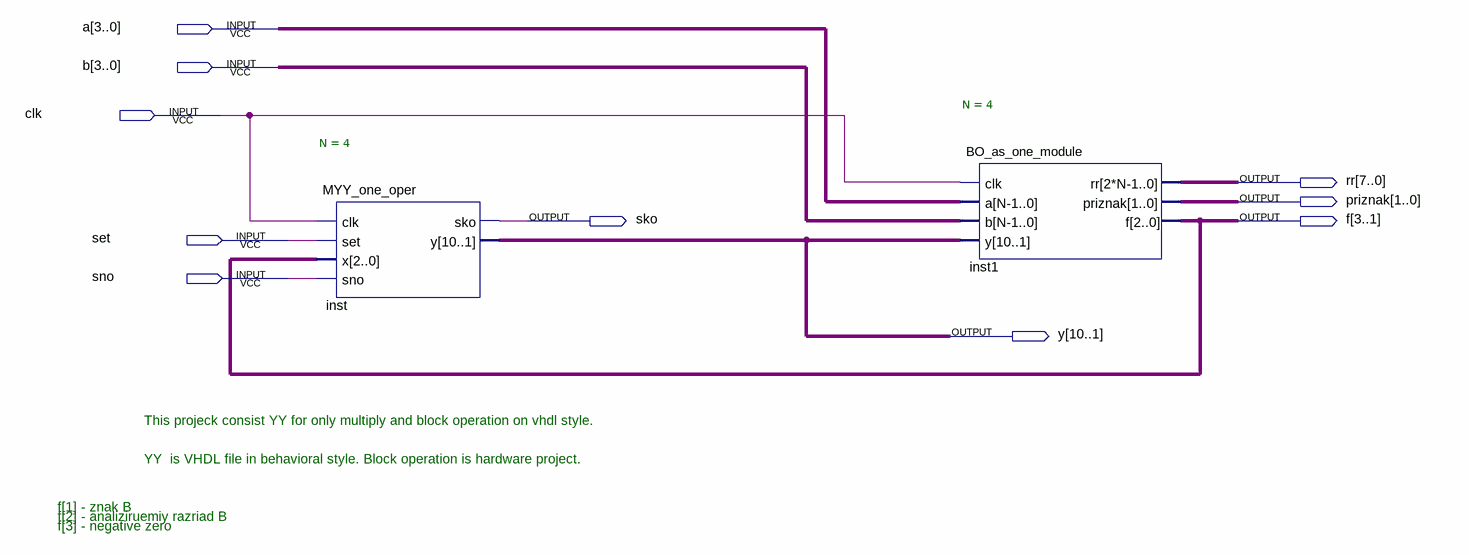
[diagram p0: schematic sheet]
// Quartus schematic alu_vhdl.bdf as structural Verilog: 2 symbols, 10 pins
module alu_vhdl (
  input  [3:0] a,
  input  [3:0] b,
  input  clk,
  input  set,
  input  sno,
  output [7:0] rr,
  output [1:0] priznak,
  output sko,
  output [3:1] f,
  output [10:1] y
);

  MYY_one_oper #(.N(4)) inst (.clk(clk), .set(set), .x(f), .sno(sno), .sko(sko), .y(y));
  BO_as_one_module #(.N(4)) inst1 (.clk(clk), .a(a), .b(b), .y(y), .rr(rr), .priznak(priznak), .f(f));

  // Notes on the sheet:
  //   This projeck consist YY for only multiply and block operation on vhdl style.
  //   YY  is VHDL file in behavioral style. Block operation is hardware project.
  //   f[1] - znak B
  //   f[2] - analiziruemiy razriad B
  //   f[3] - negative zero
endmodule
